# Altium schematic sheet ATM90E36A-AU-R1_ATM90E36A-AU-R.schdoc
size 124 x 99 mm
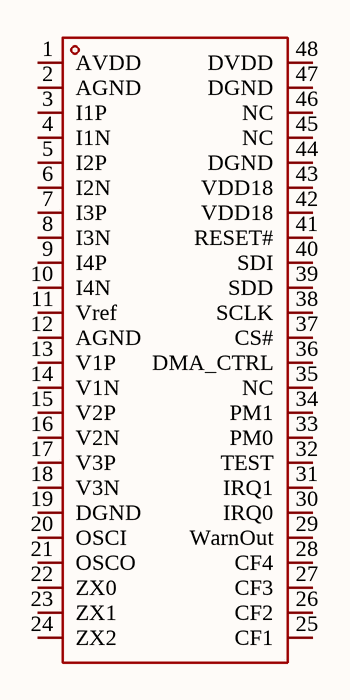
[diagram p0: ATM90E36A-AU-R1_ATM90E36A-AU-R.schdoc]

## Parts
U?  ATM90E36A-AU-R  [TQFP-48_L7.0-W7.0-P0.50-LS9.0-BL]  (value not drawn)

## Nets

Not connected (* = marked no-connect by the designer): U? 1(AVDD) 2(AGND) 3(I1P) 4(I1N) 5(I2P) 6(I2N) 7(I3P) 8(I3N) 9(I4P) 10(I4N) 11(Vref) 12(AGND) 13(V1P) 14(V1N) 15(V2P) 16(V2N) 17(V3P) 18(V3N) 19(DGND) 20(OSCI) 21(OSCO) 22(ZX0) 23(ZX1) 24(ZX2) 25(CF1) 26(CF2) 27(CF3) 28(CF4) 29(WarnOut) 30(IRQ0) 31(IRQ1) 32(TEST) 33(PM0) 34(PM1) 35(NC) 36(DMA_CTRL) 37(CS#) 38(SCLK) 39(SDD) 40(SDI) 41(RESET#) 42(VDD18) 43(VDD18) 44(DGND) 45(NC) 46(NC) 47(DGND) 48(DVDD)

## Library data of the parts
U? = ATM90E36A-AU-R: Manufacturer: MICROCHIP(美国微芯); Add into BOM: yes; Meter Type: Multiphase electricity chip; Operating Voltage: 2.8V~3.6V; Operating Current: 23mA; Symbol: ATM90E36A-AU-R; Device: ATM90E36A-AU-R; LCSC Part Name: ATM90E36A 电能计量芯片; Supplier Part: C481363; Manufacturer Part: ATM90E36A-AU-R; Supplier Footprint: TQFP-48(7x7); JLCPCB Part Class: Extended Part; Datasheet: https://atta.szlcsc.com/upload/public/pdf/source/20200107/C481363_EF826574F9F4297BF82E10A5BBC5C612.pdf; Supplier: LCSC; Convert to PCB: yes; Operating Temperature: -40℃~+85℃